# Altium schematic sheet screen.SchDoc
size Legal
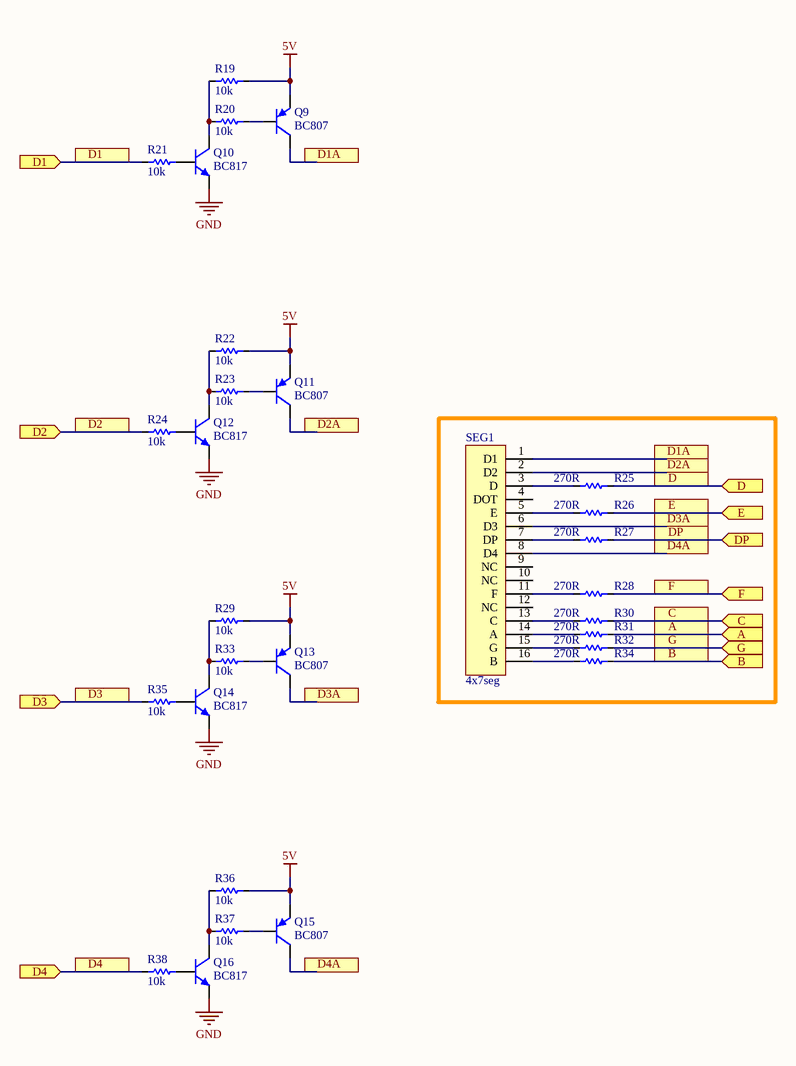
[diagram p0: screen.SchDoc]

## Parts
Q9  BC807  [SOT23-3]
Q10  BC817  [SOT23-3]
Q11  BC807  [SOT23-3]
Q12  BC817  [SOT23-3]
Q13  BC807  [SOT23-3]
Q14  BC817  [SOT23-3]
Q15  BC807  [SOT23-3]
Q16  BC817  [SOT23-3]
R19  value 10k  [Size_0603_N]  (hidden comment: 10k, *)
R20  value 10k  [Size_0603_N]  (hidden comment: 10k, *)
R21  value 10k  [Size_0603_N]  (hidden comment: 10k, *)
R22  value 10k  [Size_0603_N]  (hidden comment: 10k, *)
R23  value 10k  [Size_0603_N]  (hidden comment: 10k, *)
R24  value 10k  [Size_0603_N]  (hidden comment: 10k, *)
R25  value 270R  [Size_0603_N]  (hidden comment: 270R, *)
R26  value 270R  [Size_0603_N]  (hidden comment: 270R, *)
R27  value 270R  [Size_0603_N]  (hidden comment: 270R, *)
R28  value 270R  [Size_0603_N]  (hidden comment: 270R, *)
R29  value 10k  [Size_0603_N]  (hidden comment: 10k, *)
R30  value 270R  [Size_0603_N]  (hidden comment: 270R, *)
R31  value 270R  [Size_0603_N]  (hidden comment: 270R, *)
R32  value 270R  [Size_0603_N]  (hidden comment: 270R, *)
R33  value 10k  [Size_0603_N]  (hidden comment: 10k, *)
R34  value 270R  [Size_0603_N]  (hidden comment: 270R, *)
R35  value 10k  [Size_0603_N]  (hidden comment: 10k, *)
R36  value 10k  [Size_0603_N]  (hidden comment: 10k, *)
R37  value 10k  [Size_0603_N]  (hidden comment: 10k, *)
R38  value 10k  [Size_0603_N]  (hidden comment: 10k, *)
SEG1  4x7seg  [LTC-4627JR]

## Ports
A (in), B (in), C (in), D1 (in), D2 (in), D3 (in), D4 (in), D (in), DP (in), E (in), F (in), G (in)

## Nets
5V: Q9.2(E) Q11.2(E) Q13.2(E) Q15.2(E) R19.1 R22.1 R29.1 R36.1
GND: Q10.2(E) Q12.2(E) Q14.2(E) Q16.2(E)
A: R31.2 ; port A
B: R34.2 ; port B
C: R30.2 ; port C
D: R25.2 ; port D
D1: R21.2 ; port D1
D1A: Q9.3(C) SEG1.1(D1)
D2: R24.2 ; port D2
D2A: Q11.3(C) SEG1.2(D2)
D3: R35.2 ; port D3
D3A: Q13.3(C) SEG1.6(D3)
D4: R38.2 ; port D4
D4A: Q15.3(C) SEG1.8(D4)
DP: R27.2 ; port DP
E: R26.2 ; port E
F: R28.2 ; port F
G: R32.2 ; port G
NetQ9_1: Q9.1(B) R20.1
NetQ10_1: Q10.1(B) R21.1
NetQ10_3: Q10.3(C) R19.2 R20.2
NetQ11_1: Q11.1(B) R23.1
NetQ12_1: Q12.1(B) R24.1
NetQ12_3: Q12.3(C) R22.2 R23.2
NetQ13_1: Q13.1(B) R33.1
NetQ14_1: Q14.1(B) R35.1
NetQ14_3: Q14.3(C) R29.2 R33.2
NetQ15_1: Q15.1(B) R37.1
NetQ16_1: Q16.1(B) R38.1
NetQ16_3: Q16.3(C) R36.2 R37.2
NetR25_1: R25.1 SEG1.3(D)
NetR26_1: R26.1 SEG1.5(E)
NetR27_1: R27.1 SEG1.7(DP)
NetR28_1: R28.1 SEG1.11(F)
NetR30_1: R30.1 SEG1.13(C)
NetR31_1: R31.1 SEG1.14(A)
NetR32_1: R32.1 SEG1.15(G)
NetR34_1: R34.1 SEG1.16(B)

Not connected (* = marked no-connect by the designer): SEG1 4(DOT) 9(NC) 10(NC) 12(NC)

## Notes on the sheet
- Title
- Size:
- Date:
- Legal
- Number:
- Time:
- Revision:
- Sheet
- of
- File:

## Library data of the parts
Q9 Q11 Q13 Q15 = 1-BJT-PNP
Q10 Q12 Q14 Q16 = 1-BJT_NPN: NPN General Purpose
R19-R24 R29 R33 R35-R38 = -Res: =Value; Tolerance: .1%; Power: *
R25-R28 R30-R32 R34 = -Res: =Value; Tolerance: 1%; Power: *